# Altium project 3_BMS_Liion.PrjPcb
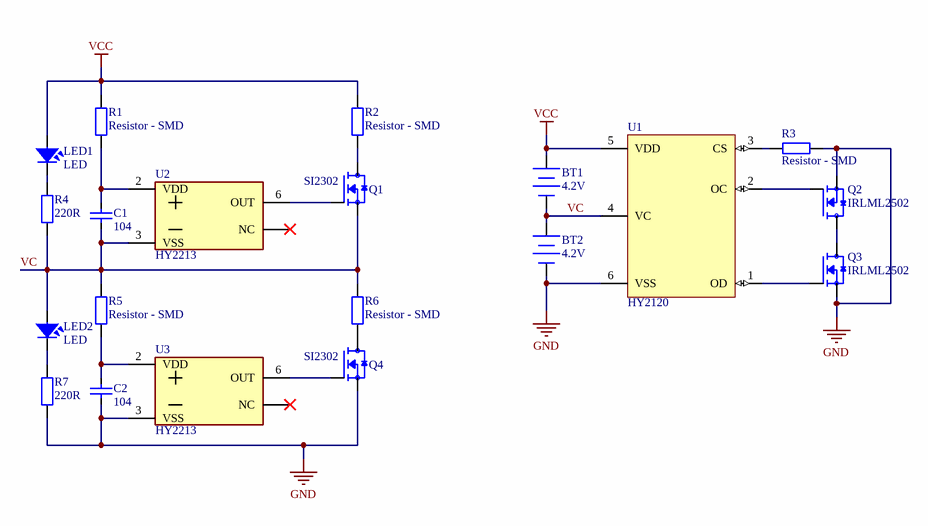
[diagram p0: Li_ion_PRT-BL.SchDoc]
1 sheet, 20 parts. Net scope: global (net labels, ports and power ports of the same name join across sheets).
Board file: BMS_2S.PcbDoc

## Sheet Li_ion_PRT-BL.SchDoc
size A4; SheetNumber: 1; SheetTotal: 1

### Parts
BT1  4.2V  [HDR2]
BT2  4.2V  [HDR2]
C1  104  [CAP_0805]
C2  104  [CAP_0805]
LED1  LED  [LED-0805-Blue]
LED2  LED  [LED-0805-Blue]
Q1  SI2302  [SOT23]
Q2  IRLML2502  [SOT23]
Q3  IRLML2502  [SOT23]
Q4  SI2302  [SOT23]
R1  Resistor - SMD  [RES-SMD-0805]
R2  Resistor - SMD  [RES-SMD-0805]
R3  Resistor - SMD  [RES-SMD-0805]
R4  220R  [RES-SMD-0805]
R5  Resistor - SMD  [RES-SMD-0805]
R6  Resistor - SMD  [RES-SMD-0805]
R7  220R  [RES-SMD-0805]
U1  HY2120  [sot23-6]
U2  HY2213  [SOT23-6]
U3  HY2213  [SOT23-6]

### Nets
GND: BT2.2(-) C2.1 Q2.3(S) Q3.3(S) Q4.2(S) R3.2 R7.2 U1.6(VSS) U3.3(VSS)
VCC: BT1.1(+) LED1.1 R1.1 R2.1 U1.5(VDD)
VC: BT1.2(-) BT2.1(+) C1.1 LED2.1 Q1.2(S) R4.2 R5.1 R6.1 U1.4(VC) U2.3(VSS)
NetC1_2: C1.2 R1.2 U2.2(VDD)
NetC2_2: C2.2 R5.2 U3.2(VDD)
NetLED1_2: LED1.2 R4.1
NetLED2_2: LED2.2 R7.1
NetQ1_1: Q1.1(G) U2.6(OUT)
NetQ1_3: Q1.3(D) R2.2
NetQ2_1: Q2.1(G) U1.2(OC)
NetQ2_2: Q2.2(D) Q3.2(D)
NetQ3_1: Q3.1(G) U1.1(OD)
NetQ4_1: Q4.1(G) U3.6(OUT)
NetQ4_3: Q4.3(D) R6.2
NetR3_1: R3.1 U1.3(CS)

Not connected (* = marked no-connect by the designer): U2 1, 4, 5(NC)*; U3 1, 4, 5(NC)*

### Library data of the parts
BT1 BT2 = Battery3.3V: Multicell Battery; Published: 24-Mar-1999; LatestRevisionDate: 17-Jul-2002; LatestRevisionNote: Re-released for DXP Platform.; PackageReference: BAT-2; Publisher: Altium Limited
C1 C2 = CapSMD: Capacitor; Value: 33p; Published: 8-Jun-2000; LatestRevisionDate: 17-Jul-2002; LatestRevisionNote: Re-released for DXP Platform.; PackageReference: RAD-0.3; Publisher: Altium Limited
LED1 LED2 = LED: LED Single colour Green and Red; Value: LED 3 ly Single Colour
Q1-Q4 = MOSFET-N
R1-R7 = Resistor - SMD: Resistor SMD; Manufacturer: Generic Components; Class: Passive; Published: 08/06/2000; Publisher: Altium Hobart Technology Centre
U1 = HY2120: 2-Cell Lithium-ion/Lithium Polymer Battery Packs Protection ICs
U2 U3 = Battery Charge Balance IC: 1 Cell Li-ion/Polymer Battery Charge Balance IC / Multi-cell Li-ion rechargeable battery packs